# EAGLE design mainProbe_ESP12 (EAGLE 9.1.1)
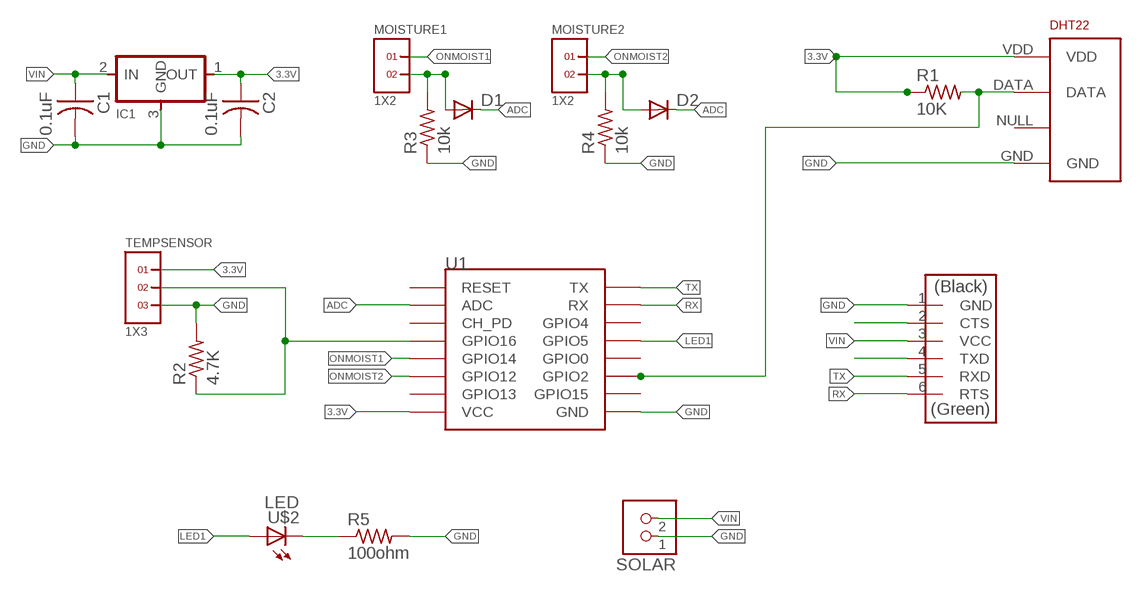
[diagram p0: schematic, sheet 1]

## Parts
C1  0.1uF  CAP-US1206  [C1206]
C2  0.1uF  CAP-US1206  [C1206]
D1  DIODESOD123  [SOD123]
D2  DIODESOD123  [SOD123]
DHT22  RHT03_DHT-22_AM2302  [RHT03_DHT-22]
IC1  REGULATORSOT23  [SOT23]
MOISTURE1  1X2  [1X2]
MOISTURE2  1X2  [1X2]
R1  10K  RES-US1206  [R1206]
R2  4.7K  RES-US1206  [R1206]
R3  10k  RES-US1206  [R1206]
R4  10k  RES-US1206  [R1206]
R5  100ohm  RES-US1206  [R1206]
SOLAR  TERM-1X02-ADAFRUIT  [3.5MMTERM]
TEMPSENSOR  1X3  [1X3]
U1  ESP12  [ESP12]
U$1  FTDI-SMD-HEADER  [1X06SMD]
U$2  LED  [LED1206]

## Nets
3.3V: C2.1 DHT22.VDD IC1.1(OUT) R1.1 TEMPSENSOR.1 U1.VCC
ADC: D1.CATHODE(C) D2.CATHODE(C) U1.ADC
GND: C1.2 C2.2 DHT22.GND IC1.3(GND) R2.2 R3.1 R4.1 R5.2 SOLAR.1 TEMPSENSOR.3 U1.GND U$1.1(GND)
LED1: U1.GPIO5 U$2.1(A)
N$2: U$1.2(CTS)
N$3: R2.1 TEMPSENSOR.2 U1.GPIO16
N$4: U$1.4(TXD)
N$5: D1.ANODE(A) MOISTURE1.2 R3.2
N$6: R5.1 U$2.2(C)
N$7: D2.ANODE(A) MOISTURE2.2 R4.2
N$8: DHT22.DATA R1.2 U1.GPIO2
ONMOIST1: MOISTURE1.1 U1.GPIO14
ONMOIST2: MOISTURE2.1 U1.GPIO12
RX: U1.RX U$1.6(RTS)
TX: U1.TX U$1.5(RXD)
VIN: C1.1 IC1.2(IN) SOLAR.2 U$1.3(VCC)
Unconnected: DHT22.NULL U1.CH_PD U1.GPIO0 U1.GPIO4 U1.GPIO13 U1.GPIO15 U1.RESET

## Library data of the parts
C1 C2 = fab:CAP-US
D1 D2 = fab:DIODE: DIODE high speed (Philips)
DHT22 = RHT03_DHT-22_AM2302:RHT03_DHT-22_AM2302: RHT03 / DHT-22 / AM2302 Packages and symbol for the RHT03 / DHT-22 relative humidity and temperature sensor. Note: The AM2302 is a wired version of the DHT-22 which typically requires less clearance and is thus provided as a separate package.; PROD_ID: SEN-10167
IC1 = fab:REGULATOR
MOISTURE1 MOISTURE2 = headers(2mm):1X2
R1-R5 = fab:RES-US: Resistor (US Symbol) Variants with postfix FAB are widened to allow the routing of internal traces
SOLAR = fab:TERM-1X02: 3.5mm terminal block, 2 positions ED555-2DS as found in the fablab inventory. Stolen from Adafruit <http://www.ladyada.net/library/pcb/eaglelibrary.html>, adapted by Zaerc.
TEMPSENSOR = headers(2mm):1X3
U1 = esp8266modules:ESP12: ESP8266 Wifi module 12
U$1 = fab:FTDI-SMD-HEADER
U$2 = fab:LED: LED

## Board
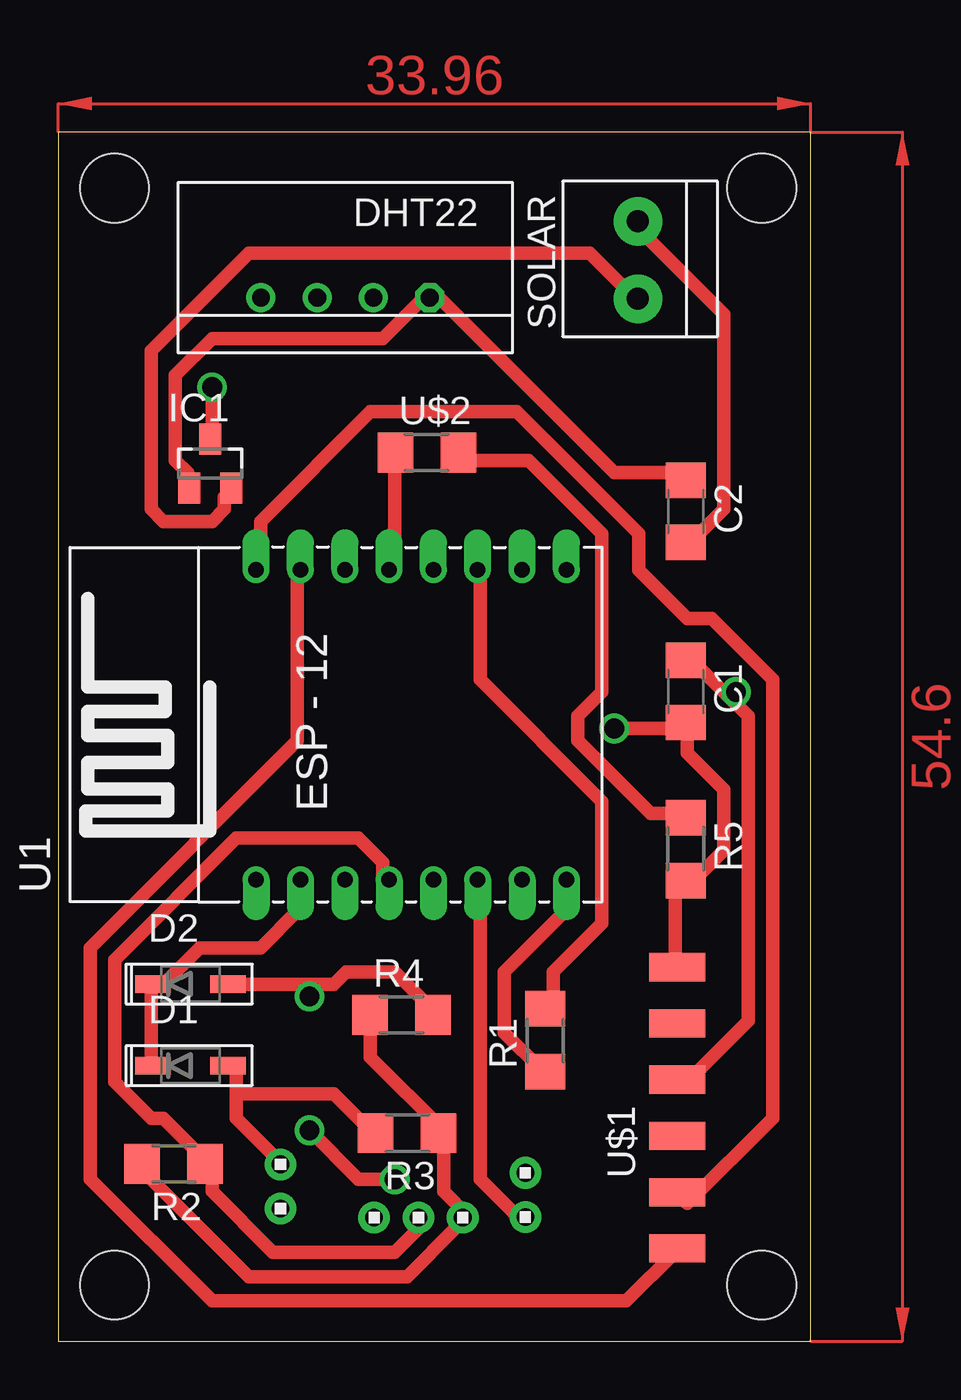
[diagram p1: board, top side]
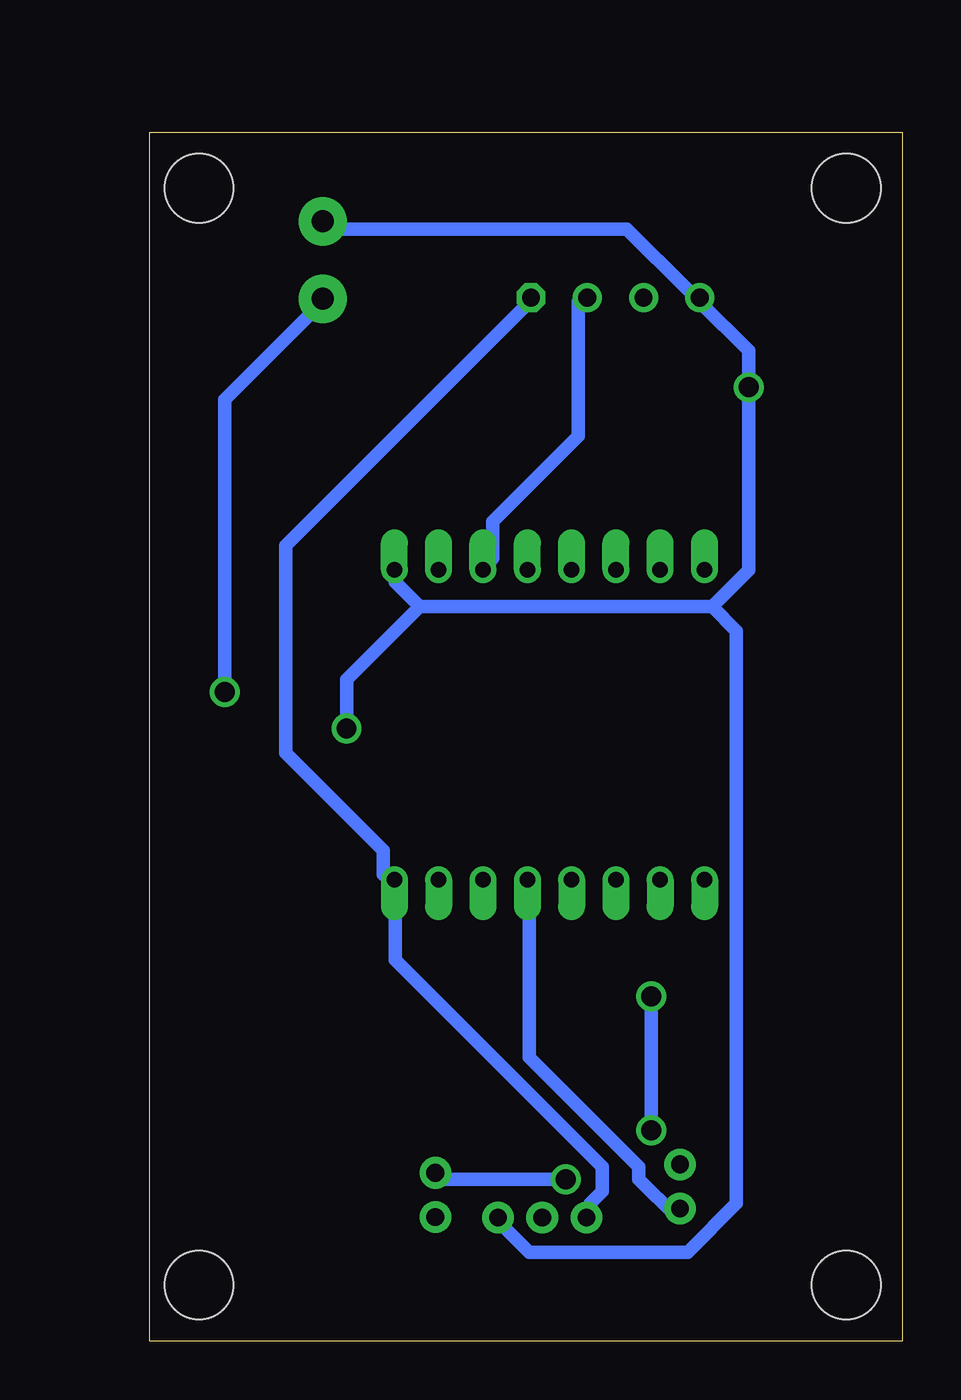
[diagram p2: board, bottom side, seen from below]

Size 33.96 x 54.6 mm. Coordinates in mm from the lower left corner, seen from the top.
Outline: 0,0 33.96,0 33.96,54.6 0,54.6 0,0
Copper layers (1*16): Top 0.035mm / dielectric 1.5mm / Bottom 0.035mm
Design rules "default *": minimum track width 0.6mm, minimum drill 0.6mm, track to track 0.5mm, track to pad 0.5mm, pad to pad 0.5mm, via to via 0.5mm, smd to smd 6mil, copper to edge 40mil, drill to drill 6mil, minimum pad ring 10mil, minimum via ring 8mil, stop-mask expansion 4mil, vias tented up to drill 0mil, thermal gap 10mil
Holes 3.1 mm at 2.54,52.07 31.75,52.07 31.75,2.54 2.54,2.54

### Footprints (pad centres in the part's own frame; a part is rotated, then mirrored left to right if it is on the bottom)
C1206 = smd 1.6 x 1.8: 1 -1.4,0; 2 1.4,0
SOD123 = smd 1.6 x 0.8: ANODE 1.7,0; CATHODE -1.7,0
RHT03_DHT-22 = drill 0.8: DATA -1.27,0; GND 3.81,0; NULL 1.27,0 | drill 0.8 octagon: VDD -3.81,0
SOT23 = smd 1 x 1.4: 1 -0.95,-1.1; 2 0.95,-1.1; 3 0,1.1
1X2 = drill 0.8 pad 1.422: 1 -1,0; 2 1,0
R1206 = smd 1.6 x 1.803: 1 -1.422,0; 2 1.422,0
3.5MMTERM = drill 1 pad 2.184: 1 1.8,0; 2 -1.7,0
1X3 = drill 0.8 pad 1.422: 1 -2,0; 2 0,0; 3 2,0
ESP12 = drill 0.7 offset: ADC -7.1,3.8; CH_PD -7.1,1.8; GND 6.9,-8.2; GPIO0 6.9,-2.2; GPIO2 6.9,-4.2; GPIO4 6.9,1.8; GPIO5 6.9,-0.2; GPIO12 -7.1,-4.2; GPIO13 -7.1,-6.2; GPIO14 -7.1,-2.2; GPIO15 6.9,-6.2; GPIO16 -7.1,-0.2; RESET -7.1,5.8; RX 6.9,3.8; TX 6.9,5.8; VCC -7.1,-8.2
1X06SMD = smd 2.54 x 1.27: 1 0,6.35; 2 0,3.81; 3 0,1.27; 4 0,-1.27; 5 0,-3.81; 6 0,-6.35
LED1206 = smd 1.6 x 1.803: 1 -1.422,0; 2 1.422,0

### Placement (x,y rotation side)
C1  28.32,29.34 270 top
C2  28.32,37.47 270 top
D1  5.97,12.45 0 top
D2  5.97,16.13 0 top
DHT22  12.95,47.12 180 top
IC1  6.86,39.62 0 top
MOISTURE1  10.03,6.98 90 top
MOISTURE2  21.08,6.6 90 top
R1  21.97,13.59 90 top
R2  5.21,8 180 top
R3  15.75,9.4 180 top
R4  15.49,14.73 0 top
R5  28.32,22.22 270 top
SOLAR  26.16,48.77 90 top
TEMPSENSOR  16.26,5.59 0 top
U1  14.73,27.94 90 top
U$1  27.94,10.54 0 top
U$2  16.64,40.13 0 top

### Tracks (layer width: path | path; a pad name or v marks a point on that pad's centre or on a via)
3.3V
  Top 0.6: R1.1 21.79,12.27 20.14,13.92 20.14,16.67 22.89,19.42 22.89,20.52 U1.VCC | IC1.1 5.84,38.67 5.84,39.22 5.29,39.77 5.29,43.62 6.94,45.27 14.64,45.27 16.29,46.92 DHT22.VDD 16.84,47.47 25.09,39.22 27.84,39.22 C2.1
  Bottom 0.6: TEMPSENSOR.1 14.09,5.67 14.09,6.22 13.54,6.77 13.54,7.87 22.89,17.22 22.89,20.52 U1.VCC 23.44,21.07 23.44,22.17 27.84,26.57 27.84,35.92 16.84,46.92 DHT22.VDD
ADC
  Top 0.6: D1.CATHODE 4.19,12.82 4.19,16.12 D2.CATHODE 4.74,16.12 6.39,17.77 9.14,17.77 10.79,19.42 10.79,20.52 U1.ADC
GND  (via drill 0.9)
  Top 0.6: R2.2 4.19,7.87 4.19,7.32 8.59,2.92 15.74,2.92 17.94,5.12 TEMPSENSOR.3 18.49,5.67 17.39,6.77 17.39,8.97 R3.1 17.39,9.52 14.09,12.82 14.09,14.47 R4.1 | C2.2 28.39,36.47 28.94,36.47 30.04,37.57 30.04,46.37 26.19,50.22 SOLAR.1 | U$1.1 27.84,17.22 27.84,20.52 R5.2 28.39,20.52 30.04,22.17 30.04,24.92 28.39,26.57 28.39,27.67 C1.2 27.84,27.67 v25.09,27.67 | v6.94,43.07 6.94,40.87 IC1.3
  Bottom 0.6: 21.79,33.17 22.89,34.27 22.89,34.82 U1.GND | 8.59,33.17 21.79,33.17 | 8.59,33.17 6.94,34.82 v6.94,43.07 6.94,44.72 9.14,46.92 DHT22.GND 9.69,47.47 12.44,50.22 25.64,50.22 SOLAR.1 | v25.09,27.67 25.09,29.87 21.79,33.17 | 8.59,33.17 7.49,32.07 7.49,6.22 9.69,4.02 16.84,4.02 17.94,5.12 TEMPSENSOR.3
LED1
  Top 0.6: U$2.1 15.19,39.77 15.19,35.37 U1.GPIO5
N$3
  Top 0.6: TEMPSENSOR.2 16.29,5.12 15.19,4.02 9.69,4.02 6.94,6.77 6.94,7.87 R2.1 6.39,8.42 4.74,10.07 4.19,10.07 2.54,11.72 2.54,17.22 8.04,22.72 13.54,22.72 14.64,21.62 14.64,21.07 U1.GPIO16
N$5
  Top 0.6: 8.04,11.17 8.04,10.07 9.69,8.42 MOISTURE1.2 | 8.04,11.17 8.04,12.27 D1.ANODE | 8.04,11.17 12.44,11.17 14.09,9.52 R3.2
N$6
  Top 0.6: U$2.2 18.49,39.77 21.24,39.77 24.54,36.47 24.54,29.32 23.44,28.22 23.44,27.12 26.74,23.82 27.84,23.82 R5.1
N$7  (via drill 0.9)
  Top 0.6: 11.34,16.12 12.44,16.12 12.99,16.67 15.19,16.67 16.84,15.02 R4.2 | 11.34,16.12 8.04,16.12 D2.ANODE | v15.19,7.32 13.54,7.32 v11.34,9.52 | 11.34,16.12 v11.34,15.57
  Bottom 0.6: v15.19,7.32 20.69,7.32 MOISTURE2.2 | v11.34,15.57 v11.34,9.52
N$8
  Top 0.6: R1.2 22.34,15.02 22.34,16.67 24.54,18.87 24.54,24.37 19.04,29.87 19.04,34.82 U1.GPIO2
  Bottom 0.6: DHT22.DATA 14.64,46.92 14.64,40.87 18.49,37.02 18.49,35.37 U1.GPIO2
ONMOIST1
  Bottom 0.6: U1.GPIO14 16.84,20.52 16.84,12.82 11.89,7.87 11.89,7.32 10.24,5.67 MOISTURE1.1
ONMOIST2
  Top 0.6: U1.GPIO12 19.04,20.52 19.04,7.32 20.69,5.67 MOISTURE2.1
RX
  Top 0.6: U1.RX 10.79,34.82 10.79,27.12 1.44,17.77 1.44,7.32 6.94,1.82 25.64,1.82 27.84,4.02 U$1.6
TX
  Top 0.6: U1.TX 9.14,35.37 9.14,37.02 14.09,41.97 20.69,41.97 26.19,36.47 26.19,34.82 28.39,32.62 29.49,32.62 32.24,29.87 32.24,10.07 28.39,6.22 U$1.5
VIN  (via drill 0.9)
  Top 0.6: 30.04,29.32 31.14,28.22 31.14,14.47 28.39,11.72 U$1.3 | 30.04,29.32 28.94,30.42 28.39,30.42 C1.1 | IC1.2 7.49,38.12 7.49,37.57 6.94,37.02 4.74,37.02 4.19,37.57 4.19,44.72 8.59,49.12 23.99,49.12 25.64,47.47 SOLAR.2 | v30.59,29.32 30.04,29.32
  Bottom 0.6: v30.59,29.32 30.59,42.52 26.19,46.92 SOLAR.2
(copper drawn outside any net)
  shapes: Top area x2